# Altium schematic sheet OD_MLB.SchDoc
size A; SheetNumber: 1; SheetTotal: 1
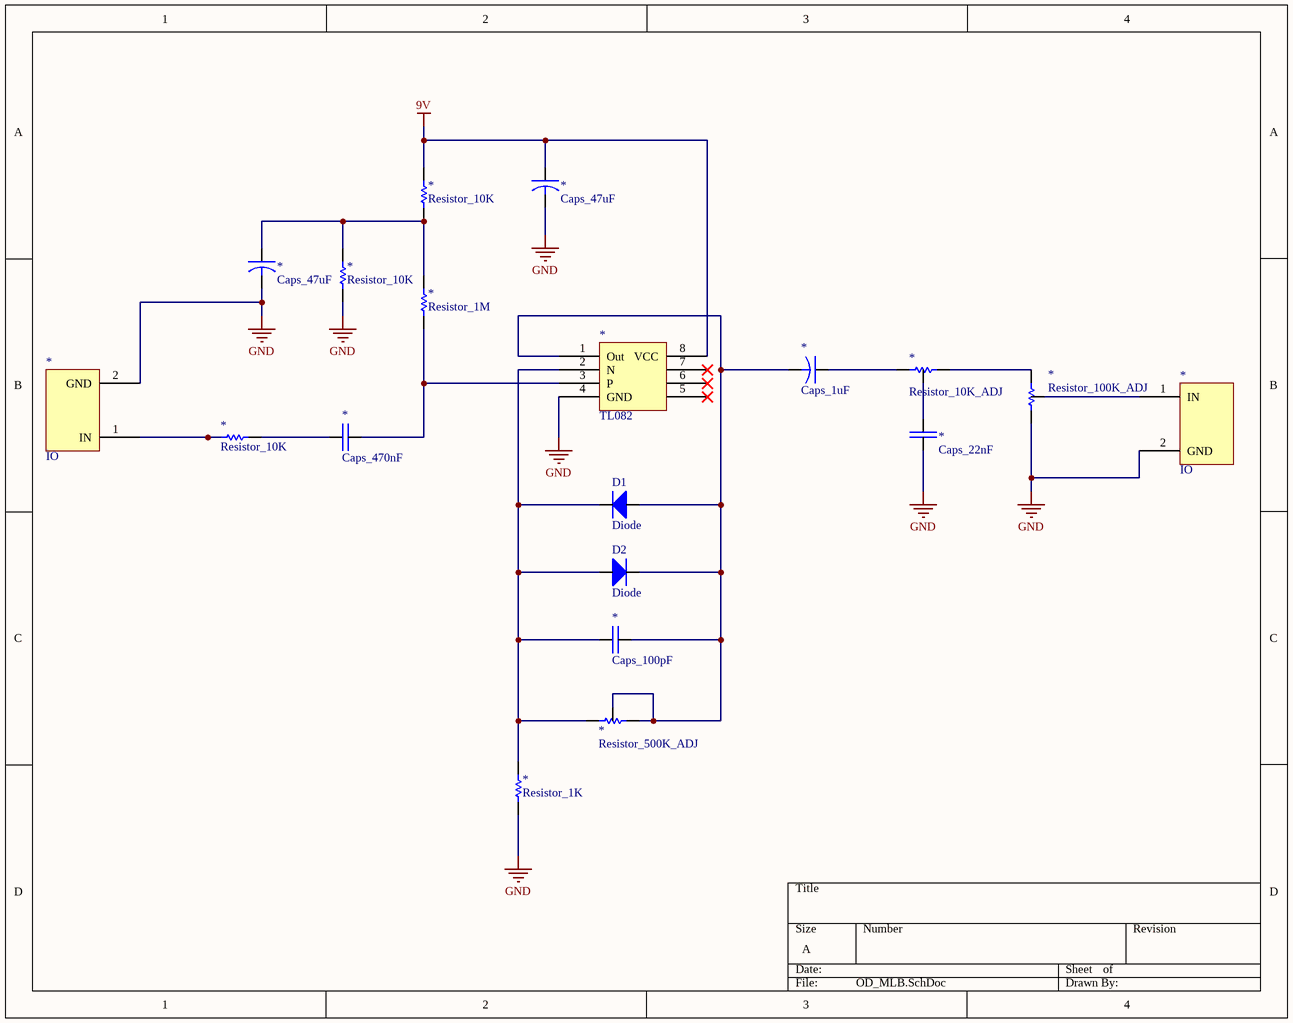
[diagram p0: OD_MLB.SchDoc]

## Parts
(Parts that share a designator on the sheet are numbered #1, #2 ... from top to bottom, then left to right.)
*#1  Caps_47uF  [Caps_47uF]
*#2  Resistor_10K  [Resistor_10k]
*#3  Caps_47uF  [Caps_47uF]
*#4  Resistor_10K  [Resistor_10k]
*#5  Resistor_1M  [Resistor_10k]
*#6  TL082  [TL082]
*#7  Caps_1uF  [Caps_47uF]
*#8  Resistor_10K_ADJ  [Resistor_10k]
*#9  Resistor_100K_ADJ  [Resistor_10k]
*#10  IO  [CAPS_100pF]
*#11  IO  [CAPS_100pF]
*#12  Caps_22nF  [CAPS_1uF]
*#13  Resistor_10K  [Resistor_10k]
*#14  Caps_470nF  [CAPS_470uF]
*#15  Caps_100pF  [CAPS_1uF]
*#16  Resistor_500K_ADJ  [Resistor_10k]
*#17  Resistor_1K  [Resistor_10k]
D1  Diode  [Diode]
D2  Diode  [Diode]

## Nets
9V: *#1.1 *#2.2 *#6.8(VCC)
GND: *#1.2 *#3.2 *#4.1 *#6.4(GND) *#9.2 *#10.2(GND) *#11.2(GND) *#12.2 *#17.1
Net*#2_1: *#2.1 *#3.1 *#4.2 *#5.2
Net*#5_1: *#5.1 *#6.3(P) *#14.2
Net*#6_1: *#6.1(Out) *#7.2 *#15.2 *#16.2 D1.2 D2.1
Net*#6_2: *#6.2(N) *#15.1 *#16.1 *#17.2 D1.1 D2.2
Net*#7_1: *#7.1 *#8.2
Net*#8_1: *#8.1 *#9.1
Net*#8_2: *#8.2 *#12.1
Net*#9_2: *#9.2 *#11.1(IN)
Net*#10_1: *#10.1(IN) *#13.1
Net*#13_2: *#13.2 *#14.1

Not connected (* = marked no-connect by the designer): *#6 5* 6* 7*